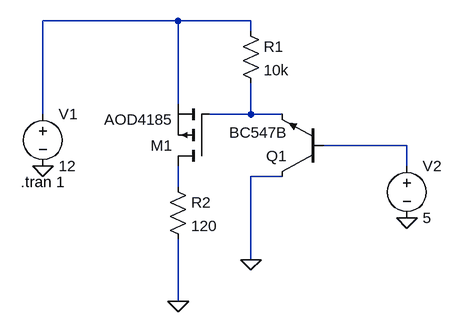
[diagram p0: schematic fanDriver.asc]
fanDriver.asc, the LTspice schematic file:
Version 4
SHEET 1 880 680
WIRE 288 16 80 16
WIRE 400 16 288 16
WIRE 400 32 400 16
WIRE 288 144 288 16
WIRE 80 160 80 16
WIRE 400 160 400 112
WIRE 400 160 336 160
WIRE 448 160 400 160
WIRE 640 208 512 208
WIRE 640 240 640 208
WIRE 448 256 400 256
WIRE 288 272 288 240
WIRE 400 384 400 256
WIRE 288 448 288 352
FLAG 80 240 0
FLAG 288 448 0
FLAG 400 384 0
FLAG 640 320 0
SYMBOL voltage 80 144 R0
WINDOW 123 0 0 Left 0
WINDOW 39 0 0 Left 0
SYMATTR InstName V1
SYMATTR Value 12
SYMBOL res 272 256 R0
SYMATTR InstName R2
SYMATTR Value 120
SYMBOL pmos 336 240 R180
SYMATTR InstName M1
SYMATTR Value AOD4185
SYMBOL res 384 16 R0
SYMATTR InstName R1
SYMATTR Value 10k
SYMBOL npn 512 256 R180
SYMATTR InstName Q1
SYMATTR Value BC547B
SYMBOL voltage 640 224 R0
WINDOW 123 0 0 Left 0
WINDOW 39 0 0 Left 0
SYMATTR InstName V2
SYMATTR Value 5
TEXT 46 264 Left 2 !.tran 1

The netlist it stands for:
* fanDriver.asc
V1 N001 0 12
R2 N004 0 120
M1 N004 N002 N001 N001 AOD4185
R1 N001 N002 10k
Q1 0 N003 N002 0 BC547B
V2 N003 0 5
.model NPN NPN
.model PNP PNP
.lib standard.bjt
.model NMOS NMOS
.model PMOS PMOS
.lib standard.mos
.tran 1
.backanno
.end